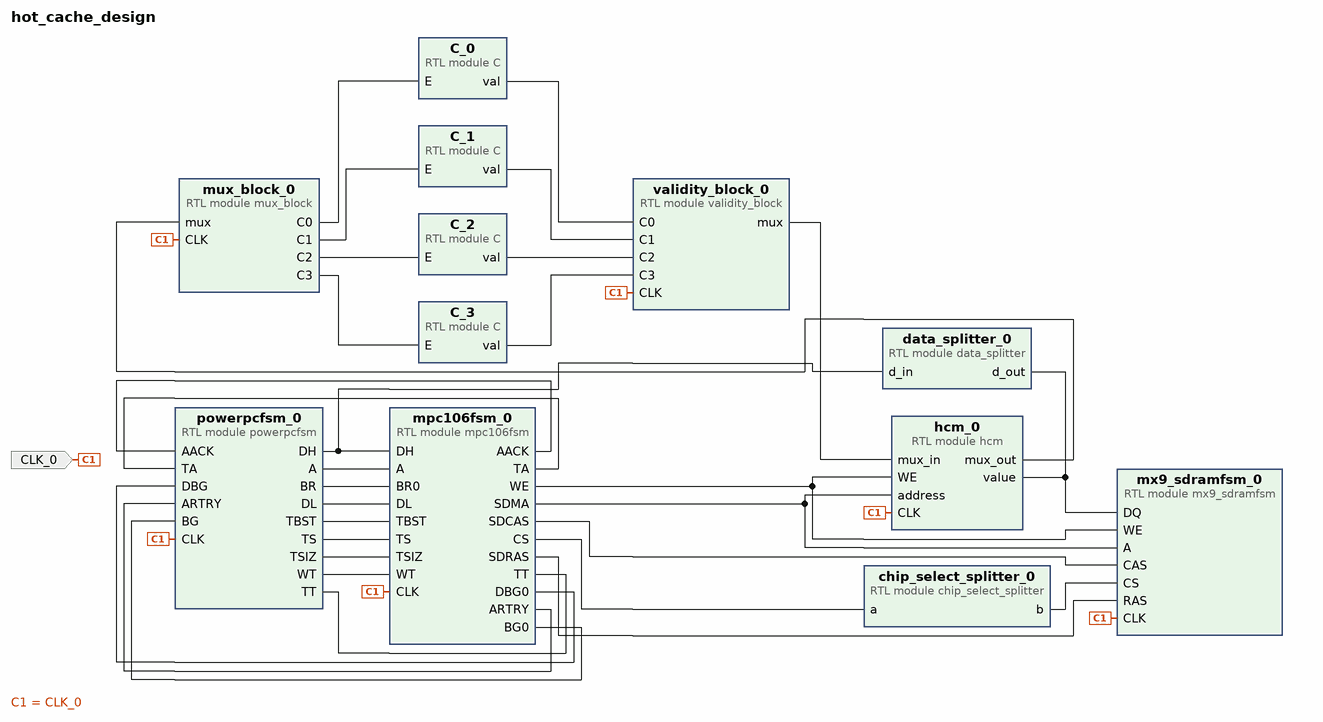
[diagram p0: block diagram of the top level]
# Vivado block design hot_cache_design, xc7a100tcsg324-1, Vivado 2018.3
create_bd_design hot_cache_design

create_bd_port -dir I -type clk CLK_0
set_property -dict {CONFIG.FREQ_HZ 500000000} [get_bd_ports CLK_0]

create_bd_cell -type module -reference powerpcfsm powerpcfsm_0
create_bd_cell -type module -reference mpc106fsm mpc106fsm_0
create_bd_cell -type module -reference data_splitter data_splitter_0
create_bd_cell -type module -reference chip_select_splitter chip_select_splitter_0
create_bd_cell -type module -reference mx9_sdramfsm mx9_sdramfsm_0
create_bd_cell -type module -reference mux_block mux_block_0
create_bd_cell -type module -reference validity_block validity_block_0
create_bd_cell -type module -reference hcm hcm_0
create_bd_cell -type module -reference C C_0
create_bd_cell -type module -reference C C_1
create_bd_cell -type module -reference C C_2
create_bd_cell -type module -reference C C_3

# ---- connections ----

connect_bd_net [get_bd_pins mpc106fsm_0/AACK] [get_bd_pins powerpcfsm_0/AACK]
connect_bd_net [get_bd_pins mpc106fsm_0/TA] [get_bd_pins powerpcfsm_0/TA]
connect_bd_net [get_bd_pins powerpcfsm_0/A] [get_bd_pins mpc106fsm_0/A]
connect_bd_net [get_bd_pins powerpcfsm_0/BR] [get_bd_pins mpc106fsm_0/BR0]
connect_bd_net [get_bd_pins powerpcfsm_0/DH] [get_bd_pins mpc106fsm_0/DH] [get_bd_pins data_splitter_0/d_in]
connect_bd_net [get_bd_pins powerpcfsm_0/DL] [get_bd_pins mpc106fsm_0/DL]
connect_bd_net [get_bd_pins powerpcfsm_0/TBST] [get_bd_pins mpc106fsm_0/TBST]
connect_bd_net [get_bd_pins powerpcfsm_0/TS] [get_bd_pins mpc106fsm_0/TS]
connect_bd_net [get_bd_pins powerpcfsm_0/TSIZ] [get_bd_pins mpc106fsm_0/TSIZ]
connect_bd_net [get_bd_pins powerpcfsm_0/WT] [get_bd_pins mpc106fsm_0/WT]
connect_bd_net [get_bd_pins powerpcfsm_0/TT] [get_bd_pins mpc106fsm_0/TT]
connect_bd_net [get_bd_pins mpc106fsm_0/WE] [get_bd_pins mx9_sdramfsm_0/WE] [get_bd_pins hcm_0/WE]
connect_bd_net [get_bd_pins mpc106fsm_0/SDCAS] [get_bd_pins mx9_sdramfsm_0/CAS]
connect_bd_net [get_bd_pins mpc106fsm_0/SDRAS] [get_bd_pins mx9_sdramfsm_0/RAS]
connect_bd_net [get_bd_pins mpc106fsm_0/SDMA] [get_bd_pins mx9_sdramfsm_0/A] [get_bd_pins hcm_0/address]
connect_bd_net [get_bd_pins chip_select_splitter_0/b] [get_bd_pins mx9_sdramfsm_0/CS]
connect_bd_net [get_bd_pins data_splitter_0/d_out] [get_bd_pins mx9_sdramfsm_0/DQ] [get_bd_pins hcm_0/value]
connect_bd_net [get_bd_pins mpc106fsm_0/DBG0] [get_bd_pins powerpcfsm_0/DBG]
connect_bd_net [get_bd_pins mpc106fsm_0/CS] [get_bd_pins chip_select_splitter_0/a]
connect_bd_net [get_bd_pins mpc106fsm_0/ARTRY] [get_bd_pins powerpcfsm_0/ARTRY]
connect_bd_net [get_bd_pins mpc106fsm_0/BG0] [get_bd_pins powerpcfsm_0/BG]
connect_bd_net [get_bd_pins mux_block_0/C0] [get_bd_pins C_0/E]
connect_bd_net [get_bd_pins mux_block_0/C1] [get_bd_pins C_1/E]
connect_bd_net [get_bd_pins mux_block_0/C2] [get_bd_pins C_2/E]
connect_bd_net [get_bd_pins mux_block_0/C3] [get_bd_pins C_3/E]
connect_bd_net [get_bd_pins C_0/val] [get_bd_pins validity_block_0/C0]
connect_bd_net [get_bd_pins C_1/val] [get_bd_pins validity_block_0/C1]
connect_bd_net [get_bd_pins C_2/val] [get_bd_pins validity_block_0/C2]
connect_bd_net [get_bd_pins C_3/val] [get_bd_pins validity_block_0/C3]
connect_bd_net [get_bd_pins hcm_0/mux_out] [get_bd_pins mux_block_0/mux]
connect_bd_net [get_bd_pins validity_block_0/mux] [get_bd_pins hcm_0/mux_in]
connect_bd_net -net CLK_0_1 [get_bd_ports CLK_0] \
  [get_bd_pins powerpcfsm_0/CLK] [get_bd_pins mux_block_0/CLK] [get_bd_pins validity_block_0/CLK] [get_bd_pins hcm_0/CLK] \
  [get_bd_pins mx9_sdramfsm_0/CLK] [get_bd_pins mpc106fsm_0/CLK]

validate_bd_design
save_bd_design
